# Altium project Newton_Alpha.PrjPcb
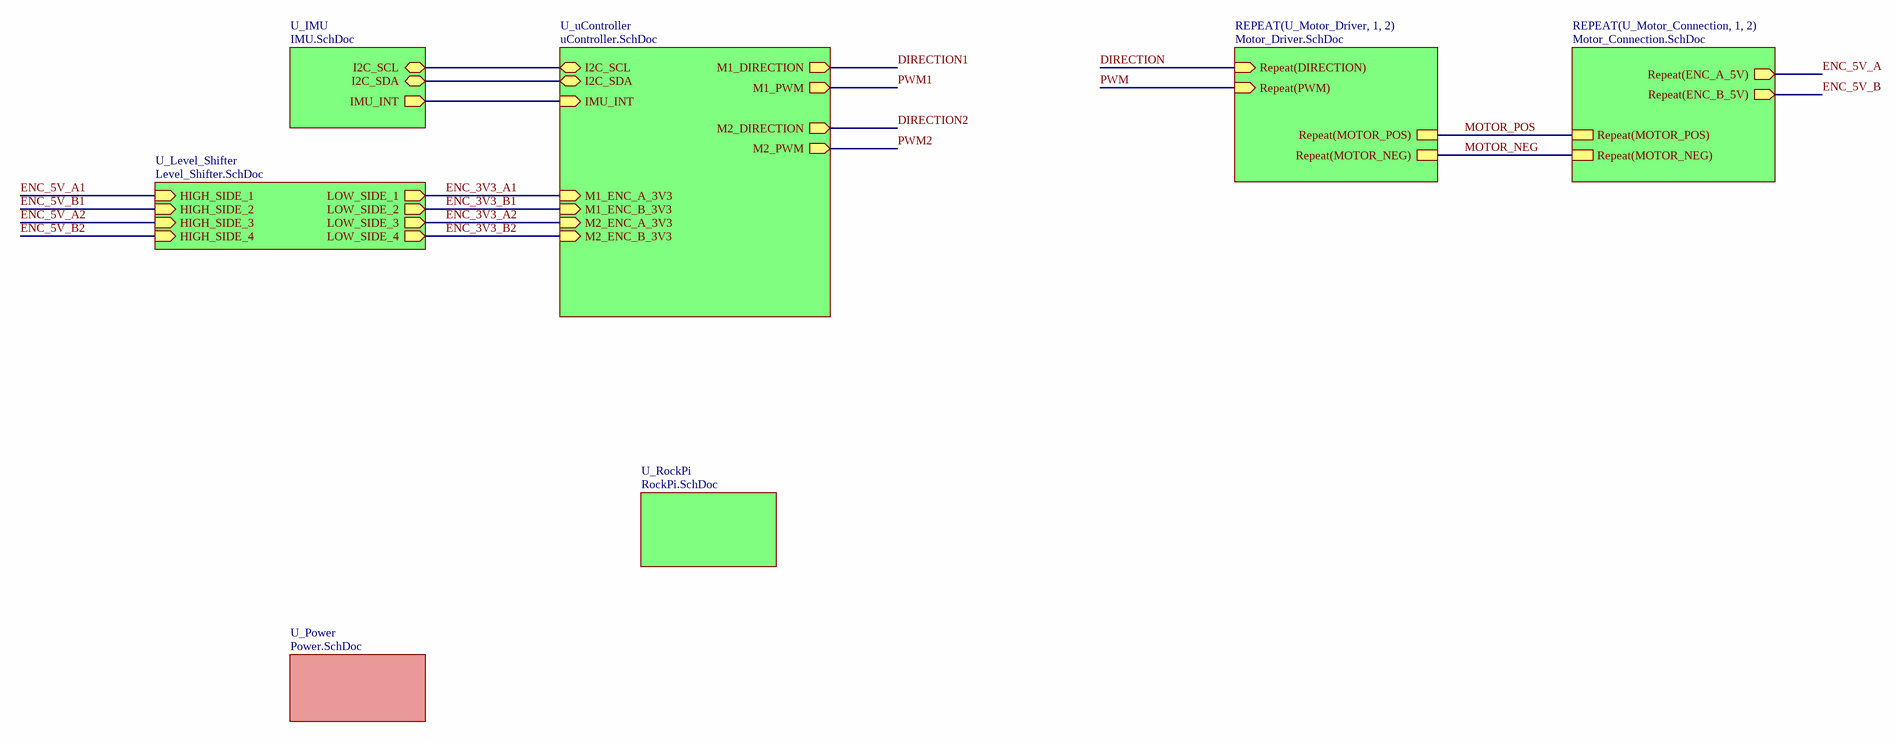
[diagram p0: main.SchDoc]
author: Jamie Smith; microcontroller_sheet_title: microcontroller; revision: A; sheet_total: 3
6 sheets, 83 parts. Net scope: hierarchical (ports join the sheet entries above them; power ports are global).
Board file: PCB-1234.PcbDoc
Sheets:
  main.SchDoc
    U_Power = power.SchDoc
    U_Level_Shifter = Level_Shifter.SchDoc
  headers.SchDoc
  Debug.SchDoc
  microcontroller.SchDoc

## Sheet main.SchDoc
size A3; SheetNumber: 1; SheetTotal: 9

### Sub-sheets
REPEAT(U_Motor_Connection, 1, 2) = Motor_Connection.SchDoc (file not in this document): Repeat(MOTOR_POS), Repeat(MOTOR_NEG), Repeat(ENC_A_5V) (out), Repeat(ENC_B_5V) (out)
REPEAT(U_Motor_Driver, 1, 2) = Motor_Driver.SchDoc (file not in this document): Repeat(DIRECTION) (in), Repeat(MOTOR_NEG), Repeat(MOTOR_POS), Repeat(PWM) (in)
U_IMU = IMU.SchDoc (file not in this document): I2C_SDA (bidir), I2C_SCL (bidir), IMU_INT (out)
U_Level_Shifter = Level_Shifter.SchDoc: HIGH_SIDE_1 (in), HIGH_SIDE_2 (in), HIGH_SIDE_3 (in), HIGH_SIDE_4 (in), LOW_SIDE_1 (out), LOW_SIDE_2 (out), LOW_SIDE_3 (out), LOW_SIDE_4 (out)
U_Power = Power.SchDoc: no entries
U_RockPi = RockPi.SchDoc (file not in this document): no entries
U_uController = uController.SchDoc (file not in this document): M1_PWM (out), M1_DIRECTION (out), I2C_SCL (bidir), M2_PWM (out), M2_DIRECTION (out), I2C_SDA (bidir), IMU_INT (in), M1_ENC_A_3V3 (in), M1_ENC_B_3V3 (in), M2_ENC_A_3V3 (in), M2_ENC_B_3V3 (in)

### Nets
DIRECTION: sheet REPEAT(U_Motor_Driver, 1, 2)/Repeat(DIRECTION)
DIRECTION1: sheet U_uController/M1_DIRECTION
DIRECTION2: sheet U_uController/M2_DIRECTION
ENC_3V3_A1: sheet U_uController/M1_ENC_A_3V3, sheet U_Level_Shifter/LOW_SIDE_1
ENC_3V3_A2: sheet U_uController/M2_ENC_A_3V3, sheet U_Level_Shifter/LOW_SIDE_3
ENC_3V3_B1: sheet U_uController/M1_ENC_B_3V3, sheet U_Level_Shifter/LOW_SIDE_2
ENC_3V3_B2: sheet U_uController/M2_ENC_B_3V3, sheet U_Level_Shifter/LOW_SIDE_4
ENC_5V_A: sheet REPEAT(U_Motor_Connection, 1, 2)/Repeat(ENC_A_5V)
ENC_5V_B: sheet REPEAT(U_Motor_Connection, 1, 2)/Repeat(ENC_B_5V)
MOTOR_NEG: sheet REPEAT(U_Motor_Driver, 1, 2)/Repeat(MOTOR_NEG), sheet REPEAT(U_Motor_Connection, 1, 2)/Repeat(MOTOR_NEG)
MOTOR_POS: sheet REPEAT(U_Motor_Driver, 1, 2)/Repeat(MOTOR_POS), sheet REPEAT(U_Motor_Connection, 1, 2)/Repeat(MOTOR_POS)
PWM: sheet REPEAT(U_Motor_Driver, 1, 2)/Repeat(PWM)
PWM1: sheet U_uController/M1_PWM
PWM2: sheet U_uController/M2_PWM
(unnamed): sheet U_uController/I2C_SCL, sheet U_IMU/I2C_SCL
(unnamed): sheet U_uController/I2C_SDA, sheet U_IMU/I2C_SDA
(unnamed): sheet U_uController/IMU_INT, sheet U_IMU/IMU_INT

### Notes on the sheet
- Sheet Title
- Design Title
- Sheet
- SIZE
- A3
- Designer
- PCB Code
- PCB Rev
- Approver
- Assembly Code
- Issue
- EC No.
- Approved Date

## Sheet power.SchDoc: Power Regulation
size A4; SheetNumber: 2; SheetTotal: 8
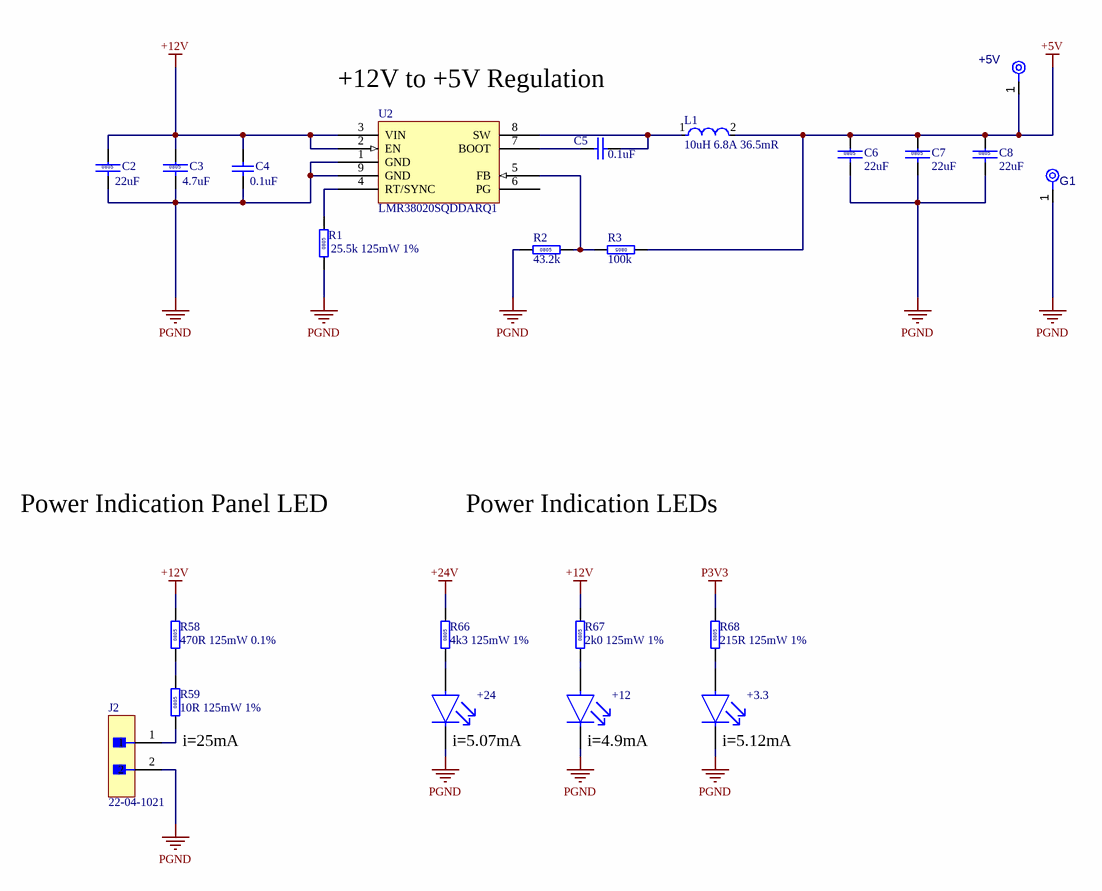
[diagram p1: power.SchDoc]

### Parts
(Parts that share a designator on the sheet are numbered #1, #2 ... from top to bottom, then left to right.)
+3.3  KPTR-3216SGC  [KPTR-3216SGC-Footprint-1 T-variant]  (value not drawn)
+5V  1.7mm Testpoint  [TestPoint_1-7thp]  (value not drawn)  (no BOM)
+12  KPTR-3216SGC  [KPTR-3216SGC-Footprint-1 T-variant]  (value not drawn)
+24  KPTR-3216SGC  [KPTR-3216SGC-Footprint-1 T-variant]  (value not drawn)
C2#1  22uF  [CAPC2012X14N]
C3#1  4.7uF  [CAPC2012X14N]
C4#1  0.1uF  [CAPC2012X14N]
C5#1  0.1uF  [CAPC2012X14N]
C6#1  22uF  [CAPC2012X14N]
C7#1  22uF  [CAPC2012X14N]
C8#1  22uF  [CAPC2012X14N]
G1  1.7mm Testpoint  [TestPoint_1-7thp]  (value not drawn)  (no BOM)
J2#1  22-04-1021  [0022041021_MFG]
L1  10uH 6.8A 36.5mR  [FP-IHLP-4040DZ-FP_3_124x3-MFG]
R1#1  25.5k 125mW 1%  [RESC2013X60X35NL10T20]
R2#1  43.2k  [RESC2013X60X35NL10T20]
R3#1  100k  [RESC2013X60X35NL10T20]
R58  470R 125mW 0.1%  [RESC2013X60X35NL10T20]
R59  10R 125mW 1%  [RESC2013X60X35NL10T20]
R66  4k3 125mW 1%  [RESC2013X60X35NL10T20]
R67  2k0 125mW 1%  [RESC2013X60X35NL10T20]
R68  215R 125mW 1%  [RESC2013X60X35NL10T20]
U2#1  LMR38020SQDDARQ1  [SOIC127P600X170_HS-9N]

### Nets
+5V: +5V.1(TP) C6#1.1 C7#1.1 C8#1.1 L1.2 R3#1.1
+12V: C2#1.1 C3#1.1 C4#1.2 R58.2 R67.2 U2#1.2(EN) U2#1.3(VIN)
+24V: R66.2
P3V3: R68.2
PGND: +3.3.2(C) +12.2(C) +24.2(C) C2#1.2 C3#1.2 C4#1.1 C6#1.2 C7#1.2 C8#1.2 G1.1(TP) J2#1.2 R1#1.1 R2#1.1 U2#1.1(GND) U2#1.9(GND)
Net+3.3_1: +3.3.1(A) R68.1
Net+12_1: +12.1(A) R67.1
Net+24_1: +24.1(A) R66.1
NetC5#1_1: C5#1.1 L1.1 U2#1.8(SW)
NetC5#1_2: C5#1.2 U2#1.7(BOOT)
NetJ2#1_1: J2#1.1 R59.1
NetR1#1_2: R1#1.2 U2#1.4(RT/SYNC)
NetR2#1_2: R2#1.2 R3#1.2 U2#1.5(FB)
NetR58_1: R58.1 R59.2

Not connected (* = marked no-connect by the designer): U2#1 6(PG)

### Notes on the sheet
- +12V to +5V Regulation
- Power Indication Panel LED
- Power Indication LEDs
- (near R59) i=25mA
- (near +24) i=5.07mA
- (near +12) i=4.9mA
- (near +3.3) i=5.12mA

### Library data of the parts
+3.3 +12 +24 = CMP-40-060-00012-8: Single Color LED, Super Bright Green, Water Clear, 1.6mm; Manufacturer: Kingbright; Reverse Voltage-Max: 5V; Overall Height: 1.05mm; Forward Current: 25mA; Forward Voltage: 2.5V; Channels: 1; Shape: Rectangular; ComponentLinkDescription: Datasheet; Luminous Intensity-Nom: 15mcd; Viewing Angle: 120°; Luminous Intensity-Min: 120cd; Packaging: Tape and Reel; Maximum Operating Temperature: 85°C; Color: Green; Min Operating Temperature: -40°C; Mounting Technology: Surface Mount; Reach SVHC Compliant: Yes; Color@wavelength: Green; Lens Style: WATER CLEAR; Terminal Pitch: 3.6mm; ForwardVoltage: 2.5V; ManufacturerPartNumber: KPTR-3216SGC; ComponentLinkURL: https://datasheet.ciiva.com/pdfs/VipMasterIC/IC/KNGB/KNGBS03251/KNGBS03251-1.pdf?src-supplier=IHS+Markit; Minimum Operating Temperature: -40°C; Max Operating Temperature: 85°C; RoHS Compliant: Yes; MountingType: SMD; Size: 1.6mm; Pins: 2; Optoelectronic Device Type: SINGLE COLOR LED; Colour: Super Bright Green; Package: 1206
+5V G1 = CMP-40-090-00002-6: NON BOM, Tespoint, Plated, Electrically Connected
C2#1 C6#1 C7#1 C8#1 = CMP-40-005-00017-4: Cap, SMD, 22uF, 25V, 15%, 0805, X5R; Manufacturer: Murata; ManufacturerPartNumber: GRM21BR61E226ME44L; ComponentLinkDescription: Datasheet; CapacitorType: Ceramic; Value: 22µF; MountingType: SMD; DielectricType: X5R; ComponentLinkURL: https://www.murata.com/en-us/products/productdetail?partno=GRM21BR61E226ME44%23; Package: 0805; VoltageRating: 25V; Tolerance: 15%
C3#1 = CMP-40-005-00016-4: Cap, SMD, 4.7uF, 50V, 10%, 0805, X5R; Manufacturer: Murata; ManufacturerPartNumber: GRM21BR61H475KE51L; ComponentLinkDescription: Datasheet; Value: 4.7µF; CapacitorType: Ceramic; DielectricType: X5R; Package: 0805; VoltageRating: 50V; MountingType: SMD; Tolerance: 10%; ComponentLinkURL: https://www.murata.com/en-us/products/productdetail?partno=GRM21BR61H475KE51%23
C4#1 C5#1 = CMP-40-005-00117-1: Cap, SMD, 0.1uF, 50V, 10%, 0805, X7R; Manufacturer: Samsung; ManufacturerPartNumber: CL21B104KBCWPNC; CapacitorType: Ceramic; Value: 100nF; ComponentLinkDescription: Datasheet; Package: 0805; MountingType: SMD; VoltageRating: 50V; Tolerance: 10%; ComponentLinkURL: https://octopart.com/part/samsung-electro-mechanics/CL21B104KBCWPNC; DielectricType: Ceramic
J2#1 = CMP-40-050-00147-1: Pin Header, Wire-to-Board, 2.5 mm, 1 Rows, 2 Contacts, Through Hole Straight, KK 5045 Series; Manufacturer: Molex; Current Rating: 3A; ComponentLinkDescription: Datasheet; Jack/Receptacle: Male; Number of Ways: 2; MountingType: Through hole; ManufacturerPartNumber: 22-04-1021; ConnectorType: Header; Number of Rows: 1; ComponentLinkURL: https://octopart.com/part/molex/22-04-1021
L1 = CMP-40-020-00018-1: Ind, SMD, 10uH, 46.5mR, las = 12.0A; Manufacturer: Vishay; ManufacturerPartNumber: IHLP4040DZER100MA1; Value: 10µH; Saturation Current: 12A; Tolerance: 20%; ComponentLinkDescription: Datasheet; MountingType: 2; Max Current Rating: 6.8A; ComponentLinkURL: https://octopart.com/part/vishay/IHLP4040DZER100MA1; Package: Nonstamdard
R1#1 = CMP-40-025-00256-1: Res, SMD, 25.5k, 125mW, 1%, ±100ppm, 0805; ManufacturerPartNumber: ERJ-6ENF2552V; Manufacturer: Panasonic; ComponentLinkDescription: Datasheet; Package Height: 0.6mm; Voltage Rating: 150V; Temperature Coefficient (ppm/cel): ±100ppm; RoHS3Compliant: Yes; Max Operating Temperature: 155°C; Mount: SMD; Min Operating Temperature: -55°C; Composition: Thick Film; Case/Package: 0805; Number of Pins: 2; Contact Plating: Tin; Power Rating: 125mW; Reach SVHC Compliant: Unaffected; Resistor Type: Fixed; ComponentLinkURL: https://octopart.com/part/panasonic/ERJ-6ENF2552V; Resistance: 25.5k; Tolerance: 1%
R2#1 = CMP-40-025-00258-1: Res, SMD, 43.2k 125mW, 0.1%, ±25ppm, 0805; ManufacturerPartNumber: ERA6AEB4322V; Manufacturer: Panasonic; Voltage Rating: 100V; ComponentLinkDescription: Datasheet; Package Height: 0.6mm; Composition: Metal Film, Thin Film; ComponentLinkURL: https://octopart.com/part/panasonic/ERA6AEB4322V; Temperature Coefficient (ppm/cel): ±25ppm; Tolerance: 0.1%; Case/Package: 0805; Max Operating Temperature: 155°C; Power Rating: 125mW; RoHS3Compliant: Yes; Reach SVHC Compliant: Unaffected; Min Operating Temperature: -55°C; Mount: SMD; Contact Plating: Tin; Resistor Type: Fixed; Number of Pins: 2; Resistance: 43.2k
R3#1 = CMP-40-025-00231-1: Res, SMD, 100k, 125mW, 0.1%, ±25ppm, 0805; Manufacturer: Panasonic; ManufacturerPartNumber: ERA-6AEB104V; Voltage Rating: 100V; ComponentLinkDescription: Datasheet; Package Height: 0.6; Power Rating: 125mW; Resistor Type: Fixed; RoHS3Certificate: https://download.siliconexpert.com/pdfs2/2024/6/2/9/59/48/925943/pns_/manual/erj6enf2700v_rohs.pdf; Mount: SMD; Case/Package: 0805; Composition: Thin Film; Temperature Coefficient (ppm/cel): ±25ppm; Min Operating Temperature: -55°C; ComponentLinkURL: https://octopart.com/era-6aeb104v-panasonic-1193246; Tolerance: 0.1%; Number of Pins: 2; Reach SVHC Compliant: Unaffected; RoHS3Compliant: Yes (with excemption); Contact Plating: Tin; Max Operating Temperature: 155°C; Resistance: 100k
R58 = CMP-40-025-00266-1: Res, SMD, 470R, 125mW, 0.1%, ±25ppm, 0805; ManufacturerPartNumber: ERA6AEB471V; Manufacturer: Panasonic; Resistance: 470; Package Height: 0.6mm; ComponentLinkDescription: Datasheet; Voltage Rating: 100V; Number of Pins: 2; ComponentLinkURL: https://octopart.com/part/panasonic/ERA6AEB471V; Case/Package: 0805; RoHS3Compliant: Yes; Tolerance: 0.1%; Resistor Type: Fixed; Reach SVHC Compliant: Unaffected; Composition: Thin Film; Temperature Coefficient (ppm/cel): ±25ppm; Max Operating Temperature: 155°C; Power Rating: 125mW; Mount: SMD; Min Operating Temperature: -55°C; Contact Plating: Tin
R59 = CMP-40-025-00265-1: Res, SMD, 10R, 125mW, 1%, ±100ppm, 0805; Manufacturer: Panasonic; ManufacturerPartNumber: ERJ-6ENF10R0V; Resistance: 10; ComponentLinkDescription: Datasheet; Voltage Rating: 150V; Package Height: 0.6mm; Min Operating Temperature: -55°C; Resistor Type: Fixed; Reach SVHC Compliant: Unaffected; Contact Plating: Tin; Temperature Coefficient (ppm/cel): ±100ppm; Mount: SMD; Power Rating: 125mW; Max Operating Temperature: 155°C; Composition: Thick Film; ComponentLinkURL: https://octopart.com/part/panasonic/ERJ-6ENF10R0V; Case/Package: 0805; Number of Pins: 2; RoHS3Compliant: Yes; Tolerance: 1%
R66 = CMP-40-025-00245-1: Res, SMD, 4k3, 125mW, 1%, ±100ppm, 0805; ManufacturerPartNumber: ERJ-6ENF4301V; Manufacturer: Panasonic; Package Height: 0.6mm; ComponentLinkDescription: Datasheet; Resistance: 4.3k; Voltage Rating: 150V; Temperature Coefficient (ppm/cel): ±100ppm; Reach SVHC Compliant: Unaffected; Tolerance: 1%; ComponentLinkURL: https://octopart.com/part/panasonic/ERJ-6ENF4301V; Power Rating: 125mW; Resistor Type: Fixed; Contact Plating: Tin; Max Operating Temperature: 155°C; Number of Pins: 2; Min Operating Temperature: -55°C; Mount: SMD; Case/Package: 0805; Composition: Thick Film; RoHS3Compliant: Yes (with excemption)
R67 = CMP-40-025-00259-1: Res, SMD, 2k0, 125mW, 1%, ±100ppm, 0805; ManufacturerPartNumber: ERJ-6ENF2001V; Manufacturer: Panasonic; Voltage Rating: 150V; Package Height: 0.6mm; ComponentLinkDescription: Datasheet; Resistance: 2k; Power Rating: 125mW; Mount: SMD; RoHS3Compliant: Yes; Case/Package: 0805; Max Operating Temperature: 155°C; Reach SVHC Compliant: Unaffected; Composition: Thick Film; Contact Plating: Tin; Tolerance: 1%; Temperature Coefficient (ppm/cel): ±100ppm; Number of Pins: 2; Min Operating Temperature: -55°C; Resistor Type: Fixed; ComponentLinkURL: https://octopart.com/part/panasonic/ERJ-6ENF2001V
R68 = CMP-40-025-00246-1: Res, SMD, 215R, 125mW, 1%, ±100ppm, 0805; ManufacturerPartNumber: ERJ-6ENF2150V; Manufacturer: Panasonic; Voltage Rating: 150V; ComponentLinkDescription: Datasheet; Package Height: 0.6; Resistance: 215; Temperature Coefficient (ppm/cel): ±100ppm; Tolerance: 1%; ComponentLinkURL: https://octopart.com/part/panasonic/ERJ-6ENF2150V; RoHS3Compliant: Yes (with excemption); Power Rating: 125mW; Reach SVHC Compliant: Unaffected; Number of Pins: 2; Composition: Thick Film; Resistor Type: Fixed; Max Operating Temperature: 155°C; Contact Plating: Tin; Mount: SMD; Min Operating Temperature: -55°C; Case/Package: 0805
U2#1 = CMP-40-080-00204-2: Switching Regulator, Current-mode, 2A, 2200kHz Switching Freq-Max, PDSO8; Manufacturer: Texas Instruments; ComponentLinkDescription: Datasheet; ComponentLinkURL: https://octopart.com/part/texas-instruments/LMR38020SQDDARQ1; Package: DDA Package, 8-Pin HSOIC; MountingType: SMD; Type: Switcher; ManufacturerPartNumber: LMR38020SQDDARQ1

## Sheet Level_Shifter.SchDoc
size A4; SheetNumber: 8; SheetTotal: 8
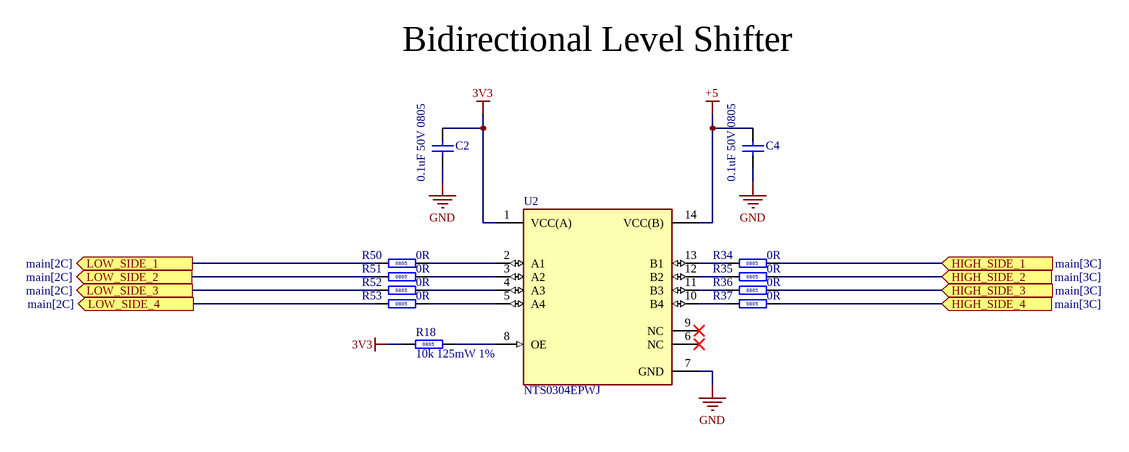
[diagram p2: Level_Shifter.SchDoc]

### Parts
(Parts that share a designator on the sheet are numbered #1, #2 ... from top to bottom, then left to right.)
C2#2  0.1uF 50V 0805  [CAPC2012X14N]
C4#2  0.1uF 50V 0805  [CAPC2012X14N]
R18  10k 125mW 1%  [RESC2013X60X35LL10T20]
R34  0R  [Copy of RESC2013X60X35NL10T20]
R35  0R  [Copy of RESC2013X60X35NL10T20]
R36  0R  [Copy of RESC2013X60X35NL10T20]
R37  0R  [Copy of RESC2013X60X35NL10T20]
R50  0R  [Copy of RESC2013X60X35NL10T20]
R51  0R  [Copy of RESC2013X60X35NL10T20]
R52  0R  [Copy of RESC2013X60X35NL10T20]
R53  0R  [Copy of RESC2013X60X35NL10T20]
U2#2  NTS0304EPWJ  [FP-SOT402-1-MFG]

### Ports
HIGH_SIDE_1 (in, see main[3C]), HIGH_SIDE_2 (in, see main[3C]), HIGH_SIDE_3 (in, see main[3C]), HIGH_SIDE_4 (in, see main[3C]), LOW_SIDE_1 (out, see main[2C]), LOW_SIDE_2 (out, see main[2C]), LOW_SIDE_3 (out, see main[2C]), LOW_SIDE_4 (out, see main[2C])

### Nets
3V3: C2#2.2 R18.1 U2#2.1(VCC(A))
+5: C4#2.2 U2#2.14(VCC(B))
GND: C2#2.1 C4#2.1 U2#2.7(GND)
ENC_3V3_A1: R50.1 ; port LOW_SIDE_1
ENC_3V3_A2: R52.1 ; port LOW_SIDE_3
ENC_3V3_B1: R51.1 ; port LOW_SIDE_2
ENC_3V3_B2: R53.1 ; port LOW_SIDE_4
ENC_5V_A1: R34.2 ; port HIGH_SIDE_1
ENC_5V_A2: R36.2 ; port HIGH_SIDE_3
ENC_5V_B1: R35.2 ; port HIGH_SIDE_2
ENC_5V_B2: R37.2 ; port HIGH_SIDE_4
NetR18_2: R18.2 U2#2.8(OE)
NetR34_1: R34.1 U2#2.13(B1)
NetR35_1: R35.1 U2#2.12(B2)
NetR36_1: R36.1 U2#2.11(B3)
NetR37_1: R37.1 U2#2.10(B4)
NetR50_2: R50.2 U2#2.2(A1)
NetR51_2: R51.2 U2#2.3(A2)
NetR52_2: R52.2 U2#2.4(A3)
NetR53_2: R53.2 U2#2.5(A4)

Not connected (* = marked no-connect by the designer): U2#2 6(NC)* 9(NC)*

### Notes on the sheet
- Bidirectional Level Shifter

### Library data of the parts
C2#2 C4#2 = CMP-40-005-00117-1: as C4#1 on sheet power; Package: 0805; MountingType: SMD; VoltageRating: 50V; Tolerance: 10%; ComponentLinkURL: https://octopart.com/part/samsung-electro-mechanics/CL21B104KBCWPNC; DielectricType: Ceramic
R18 = CMP-40-025-00226-1: Res, SMD, 10k, 125mW, 1%, ±200ppm, 0805; Manufacturer: Panasonic; ManufacturerPartNumber: ERJ-6GEYJ103V; Package Height: 0.6mm; ComponentLinkDescription: Datasheet; Voltage Rating: 150V; Tolerance: 5%; RoHS3Certificate: https://download.siliconexpert.com/pdfs2/2024/6/2/9/59/48/925943/pns_/manual/erj6enf2700v_rohs.pdf; Composition: Thick Film; Contact Plating: Tin; Reach SVHC Compliant: Unaffected; ComponentLinkURL: https://octopart.com/erj-6geyj103v-panasonic-55422885; Temperature Coefficient (ppm/cel): ±200ppm; Resistance: 10k; Max Operating Temperature: 155°C; Mount: SMD; Number of Pins: 2; Case/Package: 0805; RoHS3Compliant: Yes (with exeption); Power Rating: 125mW; Resistor Type: Fixed; Min Operating Temperature: -55°C
R34-R37 R50-R53 = CMP-40-025-00156-5: Res, SMD, 0R, 0.125W, 1%, 0805; Manufacturer: Yageo; ManufacturerPartNumber: RC0805JR-070RL; ComponentLinkDescription: Datasheet; Package Height: 0.5mm; PowerRating: 125mW; Package Length: 2mm; Value: 0; Rated Temperature: 70°C; Package Width: 1.25mm; Termination: Wraparound; Mounting Technology: Surface Mount; Resistor Type: FIXED RESISTOR; MountingType: SMD; Max Operating Temperature: 155°C; Construction: Chip; RoHS Compliant: Yes; Power: 125mW; Tolerance: 1%; Packaging: Tape and Reel; Pins: 2; Min Operating Temperature: -55°C; Package: 0805; Terminal Finish: Nickel; Package Style: SMTMeter; Case/Package: 0805; Package Shape: Rectangular; ComponentLinkURL: https://datasheet.ciiva.com/pdfs/VipMasterIC/IC/YAGO/YAGO-S-A0008145938/YAGO-S-A0008145938-1.pdf?src-supplier=IHS+Markit; Minimum Operating Temperature: -55°C; Technology: METAL GLAZE/THICK FILM; JESD-609 Code: e3; Maximum Operating Temperature: 155°C; Reach SVHC Compliant: Yes
U2#2 = CMP-10125-000002-1: 4-BIT VOLTAGE TRANSLATOR 14TSSOP; Manufacturer: NXP; Number Of Circuits: 4; Logic Function Desc: Translating Transceiver; Data Rate: 20Mbits/s; Standoff Height: 0.05mm; Min Supply Voltage: 0.95V; Nominal Supply Current: 2.2-18uA; V A Max: 4.6V; Max Supply Voltage: 5.5V; Max Junction Temp: +85°C; V B Min: -0.5V; V B Max: 6.5V; Propagation Delay: 5.3ns; Package: SOT402-1; Device Class L1: Integrated Circuits (ICs); Temperature Range High: +85°C; Number Of Outputs: 4; Temperature: -40°C to +85°C; Category: IC; Octopart: https://octopart.com/nts0304epwj-nxp+semiconductors-97865291; Ambient Temperature Range High: +125°C; Automotive: No; Device Class L3: Voltage Level Shifters; Digikey Description: 4-BIT VOLTAGE TRANSLATOR 14TSSOP; RoHS: TRUE; Lead Free: Yes; Manufacturer Part Number: NTS0304EPWJ; ComponentLink2Description: Datasheet; Number Of Inputs: 4; Footprint Url: https://www.nxp.com/docs/en/package-information/SOT402-1.pdf; Ambient Temperature Range Low: -40°C; Temperature Range Low: -40°C; V A Min: -0.5V; ComponentLink2URL: https://www.nxp.com/docs/en/data-sheet/NTS0304E.pdf; Device Class L2: Logic ICs; Height: 1.1mm

## Sheet headers.SchDoc: External Connections
size A4; SheetNumber: 6; SheetTotal: 8
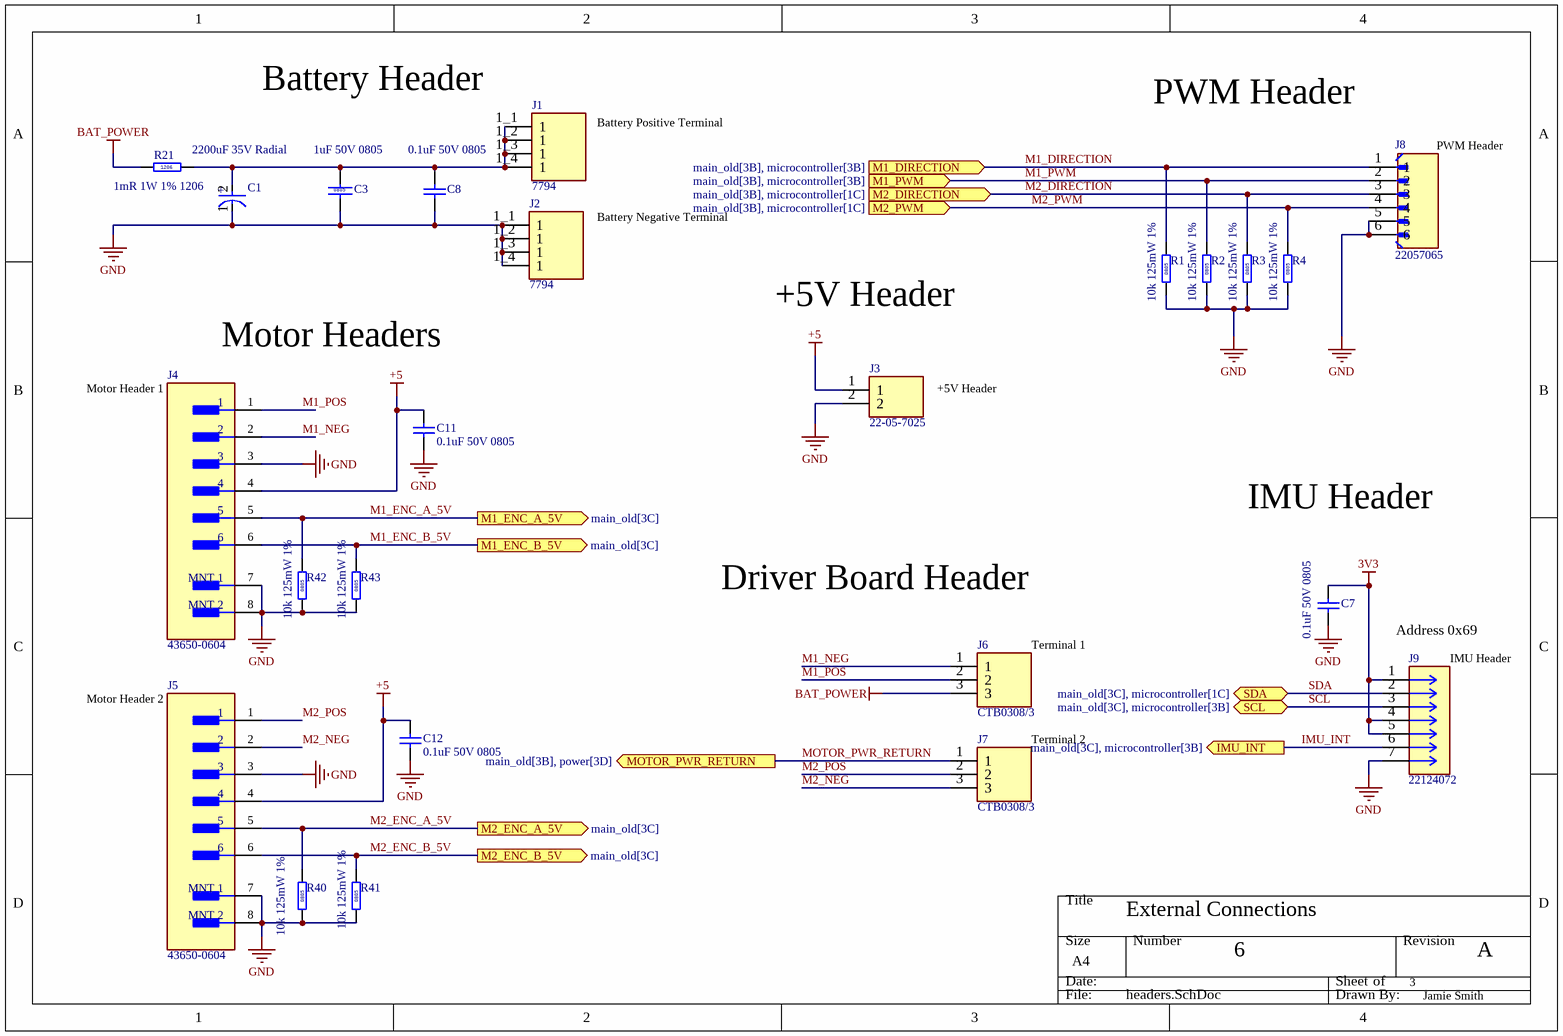
[diagram p3: headers.SchDoc]

### Parts
(Parts that share a designator on the sheet are numbered #1, #2 ... from top to bottom, then left to right.)
C1  2200uF 35V Radial  [FP-RAD-TH-D_16_0_5-L_25_2-MFG]
C3#2  1uF 50V 0805  [CAPC2012X14N]
C7#2  0.1uF 50V 0805  [CAPC2012X14N]
C8#2  0.1uF 50V 0805  [CAPC2012X14N]
C11  0.1uF 50V 0805  [CAPC2012X14N]
C12  0.1uF 50V 0805  [CAPC2012X14N]
J1  7794  [KEYSTONE_7794]
J2#2  7794  [KEYSTONE_7794]
J3  22-05-7025  [MOLEX_22-05-7025]
J4  43650-0604  [FP-43650-0604-MFG]
J5  43650-0604  [FP-43650-0604-MFG]
J6  CTB0308/3  [CTB0308_3-Footprint-1]
J7  CTB0308/3  [CTB0308_3-Footprint-1]
J8  22057065  [MOLEX_22057065]
J9  22124072  [CONN_A-7395-07B_MOL]
R1#2  10k 125mW 1%  [RESC2013X60X35ML10T20]
R2#2  10k 125mW 1%  [RESC2013X60X35ML10T20]
R3#2  10k 125mW 1%  [RESC2013X60X35ML10T20]
R4  10k 125mW 1%  [RESC2013X60X35ML10T20]
R21  1mR 1W 1% 1206  [FP-CSRF1206-IPC_A]
R40  10k 125mW 1%  [RESC2013X60X35ML10T20]
R41  10k 125mW 1%  [RESC2013X60X35ML10T20]
R42  10k 125mW 1%  [RESC2013X60X35ML10T20]
R43  10k 125mW 1%  [RESC2013X60X35ML10T20]

### Ports
IMU_INT (out, see main_old[3C], microcontroller[3B]), M1_DIRECTION (in, see main_old[3B], microcontroller[3B]), M1_ENC_A_5V (out, see main_old[3C]), M1_ENC_B_5V (out, see main_old[3C]), M1_PWM (in, see main_old[3B], microcontroller[3B]), M2_DIRECTION (in, see main_old[3B], microcontroller[1C]), M2_ENC_A_5V (out, see main_old[3C]), M2_ENC_B_5V (out, see main_old[3C]), M2_PWM (in, see main_old[3B], microcontroller[1C]), MOTOR_PWR_RETURN (out, see main_old[3B], power[3D]), SCL (bidir, see main_old[3C], microcontroller[3B]), SDA (bidir, see main_old[3C], microcontroller[1C])

### Nets
3V3: C7#2.2 J9.1 J9.4 J9.5
+5: C11.2 C12.2 J3.1 J4.4 J5.4
BAT_POWER: J6.3 R21.1
GND: C1.1(C) C3#2.2 C7#2.1 C8#2.1 C11.1 C12.1 J2#2.1_1(1) J2#2.1_2(1) J2#2.1_3(1) J2#2.1_4(1) J3.2 J4.3 J4.7(MNT_1) J4.8(MNT_2) J5.3 J5.7(MNT_1) J5.8(MNT_2) J8.5 J8.6 J9.7 R1#2.1 R2#2.1 R3#2.1 R4.1 R40.1 R41.1 R42.1 R43.1
IMU_INT: J9.6 ; port IMU_INT
M1_DIRECTION: J8.1 R1#2.2 ; port M1_DIRECTION
M1_ENC_A_5V: J4.5 R42.2 ; port M1_ENC_A_5V
M1_ENC_B_5V: J4.6 R43.2 ; port M1_ENC_B_5V
M1_NEG: J4.2 J6.1
M1_POS: J4.1 J6.2
M1_PWM: J8.2 R2#2.2 ; port M1_PWM
M2_DIRECTION: J8.3 R3#2.2 ; port M2_DIRECTION
M2_ENC_A_5V: J5.5 R40.2 ; port M2_ENC_A_5V
M2_ENC_B_5V: J5.6 R41.2 ; port M2_ENC_B_5V
M2_NEG: J5.2 J7.3
M2_POS: J5.1 J7.2
M2_PWM: J8.4 R4.2 ; port M2_PWM
MOTOR_PWR_RETURN: J7.1 ; port MOTOR_PWR_RETURN
SCL: J9.3 ; port SCL
SDA: J9.2 ; port SDA
NetC1_2: C1.2(A) C3#2.1 C8#2.2 J1.1_1(1) J1.1_2(1) J1.1_3(1) J1.1_4(1) R21.2

### Notes on the sheet
- (near J1) Battery Header
- PWM Header
- Battery Positive Terminal
- (near J8) PWM Header
- Battery Negative Terminal
- +5V Header
- Motor Headers
- Motor Header 1
- IMU Header
- Driver Board Header
- Terminal 1
- (near J9) Address 0x69
- Motor Header 2
- (near J9) IMU Header
- Terminal 2
- Sheet Title
- Design Title
- Sheet
- SIZE
- C
- Designer
- PCB Code
- PCB Rev
- Approver
- Assembly Code
- Issue
- EC No.
- Approved Date
- (in symbol CMP-05427-000859-1) +

### Library data of the parts
C1 = CMP-05427-000859-1: Aluminum Electrolytic Capacitors (Radial Lead Type) 2200uF ±20% 35V
C3#2 = CMP-40-005-00008-4: Cap, SMD, 1uF, 50V, 10%, 0805, X7R; ManufacturerPartNumber: CL21B105KBFNNN; Manufacturer: Samsung Electro Mechanics; CapacitorType: Ceramic; Value: 1µF; ComponentLinkDescription: Datasheet; VoltageRating: 50V; MountingType: SMD; Package: 0805; ComponentLinkURL: http://weblib.samsungsem.com/mlcc/mlcc-ec-data-sheet.do?partNumber=CL21B105KBFNNN; Tolerance: 10%; DielectricType: X7R
C7#2 C8#2 C11 C12 = CMP-40-005-00117-1: as C4#1 on sheet power; Package: 0805; MountingType: SMD; VoltageRating: 50V; Tolerance: 10%; ComponentLinkURL: https://octopart.com/part/samsung-electro-mechanics/CL21B104KBCWPNC; DielectricType: Ceramic
J1 J2#2 = 7794: PC SCREW TERMINAL | Keystone Electronics 7794; SnapEDA_Link: https://www.snapeda.com/parts/7794/Keystone/view-part/?ref=snap; Package: None; Value: *; MF: Keystone Electronics; MP: 7794; Check_prices: https://www.snapeda.com/parts/7794/Keystone/view-part/?ref=eda
J3 = 22-05-7025: Header 2.5mm SPOX, WTB, RA, F/lock, 2w | Molex Incorporated 22-05-7025; SnapEDA_Link: https://www.snapeda.com/parts/22-05-7025/Molex/view-part/?ref=snap; Package: None; Value: *; MF: Molex; MP: 22-05-7025; Check_prices: https://www.snapeda.com/parts/22-05-7025/Molex/view-part/?ref=eda
J4 J5 = CMP-00257-00298091-1: 43650-0604 Conn Power HDR 6 POS 3mm Solder RA Thru-Hole 6 Terminal 1 Port Micro-Fit 3.0™ Frame; Manufacturer Lifecycle Status: ACTIVE; NexarPartId: 298091; Gender: Male; Number of Contacts: 6; Current Rating: 5A; Plating: Tin; Glow Wire Compliant: Compliant; Voltage Rating: 600V; Connector Type: Male Pin; Contact Material: Brass; Color: Black; Housing Material: Plastic; Contact Gender: Male; Halogen Free: Low Halogen; Min Operating Temperature: -40°C; Pitch: 3mm; Housing Color: Black; Lifecycle Status: Production; Termination: Solder; Width: 9.9mm; Orientation: Right Angle; Length: 21.6mm; Lead Free: Contains Lead; Number of Pins: 6; Max Operating Temperature: 105°C; Number of Positions: 6; Number of Rows: 1; RoHS: Compliant; Number of Circuits: 6; Country of Origin: US; Mount: Through Hole; Contact Plating: Gold; Schedule B: 8536694040; Fastening Type: Ramp; Height: 4.37mm
J6 J7 = CMP-40-050-00115-1: Barrier Strip Terminal Block, 3 position; ManufacturerPartNumber: CTB0308_3; Manufacturer: CAMDENBOSS; VoltageRating: 130V; Number of Ways: 3; ComponentLinkDescription: Datasheet; Current Rating: 10A; Jack/Receptacle: Receptacle; ComponentLinkURL: https://datasheet.ciiva.com/pdfs/VipMasterIC/IC/CAME/CAMES00005/CAMES00005-1.pdf?src-supplier=IHS+Markit; Minimum Operating Temperature: 0°C; REACHStatement: No; Number of Rows: 1; Terminal and Terminal Block Type: BARRIER STRIP TERMINAL BLOCK; Manufacturer Series: CTB0308; RoHS3Compliant: Yes; MountingType: TH; RoHS3Certificate: Yes; ConnectorType: Terminal Block; Maximum Operating Temperature: 110°C
J8 = 22057065: Conn Shrouded Header (4 Sides) HDR 6 POS 2.5mm Solder RA Side Entry Thru-Hole SPOXâ„¢ Bag; MF: Molex; SnapEDA_Link: https://www.snapeda.com/parts/22057065/Molex/view-part/?ref=snap; Package: None; Value: *; MP: 22057065; Check_prices: https://www.snapeda.com/parts/22057065/Molex/view-part/?ref=eda
R1#2 R2#2 R3#2 R4 R40-R43 = CMP-40-025-00226-1: as R18 on sheet Level_Shifter; RoHS3Certificate: https://download.siliconexpert.com/pdfs2/2024/6/2/9/59/48/925943/pns_/manual/erj6enf2700v_rohs.pdf; Composition: Thick Film; Contact Plating: Tin; Reach SVHC Compliant: Unaffected; ComponentLinkURL: https://octopart.com/erj-6geyj103v-panasonic-55422885; Temperature Coefficient (ppm/cel): ±200ppm; Resistance: 10k; Max Operating Temperature: 155°C; Mount: SMD; Number of Pins: 2; Case/Package: 0805; RoHS3Compliant: Yes (with exeption); Power Rating: 125mW; Resistor Type: Fixed; Min Operating Temperature: -55°C
R21 = CMP-40-025-00210-2: Res, SMD, 1mR, 1W, 0.0316V, 1% +/-Tol, 50ppm/Cel, 1206; ManufacturerPartNumber: CRF1206-FZ-R001ELF; Manufacturer: Bourns; ComponentLinkDescription: Datasheet; Value: 1m; ComponentLinkURL: https://datasheet.octopart.com/CRF1206-FZ-R001ELF-Bourns-datasheet-176301116.pdf?src-supplier=Electro+Sonic; Mount: SMD; MountingType: SMD; Package: 1206; Tolerance: 1%; PowerRating: 1W
J9 = 22124072: Package: None; Price: None; Value: *; MP: 22124072; Availability: Unavailable

## Sheet Debug.SchDoc
size A4; SheetNumber: 11; SheetTotal: 13
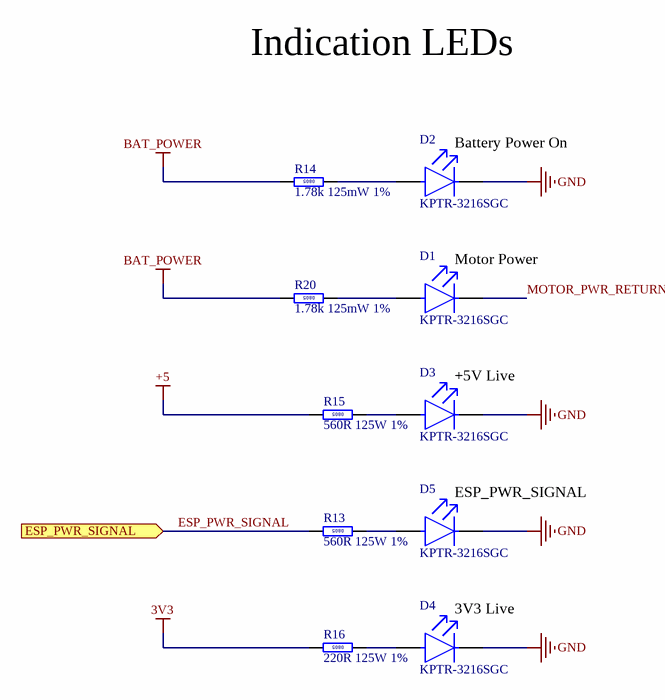
[diagram p4: Debug.SchDoc]

### Parts
D1  KPTR-3216SGC  [KPTR-3216SGC-Footprint-1]
D2  KPTR-3216SGC  [KPTR-3216SGC-Footprint-1]
D3  KPTR-3216SGC  [KPTR-3216SGC-Footprint-1]
D4  KPTR-3216SGC  [KPTR-3216SGC-Footprint-1]
D5  KPTR-3216SGC  [KPTR-3216SGC-Footprint-1]
R13  560R 125W 1%  [RESC2013X60X35LL10T20]
R14  1.78k 125mW 1%  [RESC2013X60X35LL10T20]
R15  560R 125W 1%  [RESC2013X60X35LL10T20]
R16  220R 125W 1%  [RESC2013X60X35LL10T20]
R20  1.78k 125mW 1%  [RESC2013X60X35LL10T20]

### Ports
ESP_PWR_SIGNAL (in)

### Nets
3V3: R16.2
+5: R15.2
BAT_POWER: R14.2 R20.2
GND: D2.2(C) D3.2(C) D4.2(C) D5.2(C)
ESP_PWR_SIGNAL: R13.2 ; port ESP_PWR_SIGNAL
MOTOR_PWR_RETURN: D1.2(C)
NetD1_1: D1.1(A) R20.1
NetD2_1: D2.1(A) R14.1
NetD3_1: D3.1(A) R15.1
NetD4_1: D4.1(A) R16.1
NetD5_1: D5.1(A) R13.1

### Notes on the sheet
- Indication LEDs
- (near D2) Battery Power On
- (near D1) Motor Power
- (near D3) +5V Live
- (near D5) ESP_PWR_SIGNAL
- (near D4) 3V3 Live

### Library data of the parts
D1-D5 = CMP-40-060-00012-7: Single Color LED, Super Bright Green, Water Clear, 1.6mm; Manufacturer: Kingbright; Reverse Voltage-Max: 5V; Overall Height: 1.05mm; Channels: 1; Luminous Intensity-Nom: 15mcd; Forward Voltage: 2.5V; Shape: Rectangular; Luminous Intensity-Min: 120cd; Viewing Angle: 120°; Forward Current: 25mA; ComponentLinkDescription: Datasheet; Terminal Pitch: 3.6mm; Size: 1.6mm; Colour: Super Bright Green; Min Operating Temperature: -40°C; Max Operating Temperature: 85°C; Package: 1206; ComponentLinkURL: https://datasheet.ciiva.com/pdfs/VipMasterIC/IC/KNGB/KNGBS03251/KNGBS03251-1.pdf?src-supplier=IHS+Markit; RoHS Compliant: Yes; Color@wavelength: Green; Maximum Operating Temperature: 85°C; Packaging: Tape and Reel; Minimum Operating Temperature: -40°C; ManufacturerPartNumber: KPTR-3216SGC; Pins: 2; Optoelectronic Device Type: SINGLE COLOR LED; Color: Green; MountingType: SMD; Reach SVHC Compliant: Yes; ForwardVoltage: 2.5V; Lens Style: WATER CLEAR; Mounting Technology: Surface Mount
R13 R15 R16 = CMP-40-025-00230-1: Res, SMD, 560R, 125mW, 1%, ±100ppm, 0805; Manufacturer: Panasonic; ManufacturerPartNumber: ERJ-6ENF5600V; Package Height: 0.6; ComponentLinkDescription: Datasheet; Voltage Rating: 150V; Resistance: 560; Max Operating Temperature: 155°C; Tolerance: 1%; Composition: Thick Film; Min Operating Temperature: -55°C; ComponentLinkURL: https://octopart.com/erj-6enf5600v-panasonic-55477609; RoHS3Compliant: Yes (with excemption); Case/Package: 0805; Mount: SMD; Contact Plating: Tin; RoHS3Certificate: https://download.siliconexpert.com/pdfs2/2024/6/2/9/59/48/925943/pns_/manual/erj6enf2700v_rohs.pdf; Number of Pins: 2; Power Rating: 125mW; Temperature Coefficient (ppm/cel): ±100ppm; Reach SVHC Compliant: Unaffected; Resistor Type: Fixed
R14 R20 = CMP-40-025-00237-1: Res, SMD, 1.78k, 125mW, 1%, ±100ppm, 0805; Manufacturer: Panasonic; ManufacturerPartNumber: ERJ-6ENF1781V; ComponentLinkDescription: Datasheet; Voltage Rating: 150V; Package Height: 0.6mm; Power Rating: 125mW; Composition: Thick Film; RoHS3Compliant: Yes (with excemption); Number of Pins: 2; Resistance: 1.78k; Reach SVHC Compliant: Unaffected; Case/Package: 0805; Max Operating Temperature: 155°C; Mount: SMD; Resistor Type: Fixed; ComponentLinkURL: https://octopart.com/part/panasonic/ERJ-6ENF1781V; Min Operating Temperature: -55°C; Temperature Coefficient (ppm/cel): ±100ppm; Contact Plating: Tin; Tolerance: 1%

## Sheet microcontroller.SchDoc
size A4; SheetNumber: 5; SheetTotal: 6
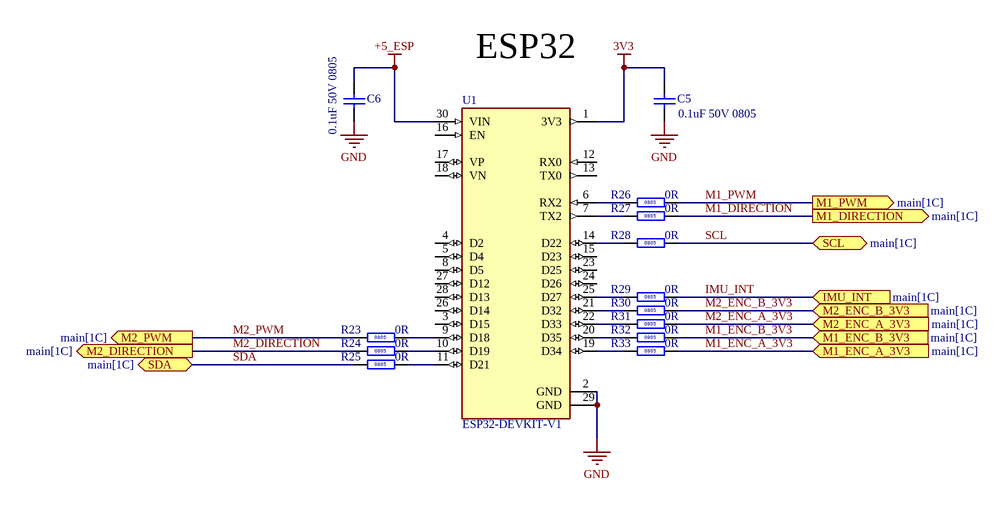
[diagram p5: microcontroller.SchDoc]

### Parts
(Parts that share a designator on the sheet are numbered #1, #2 ... from top to bottom, then left to right.)
C5#2  0.1uF 50V 0805  [CAPC2012X14N]
C6#2  0.1uF 50V 0805  [CAPC2012X14N]
R23  0R  [Copy of RESC2013X60X35NL10T20]
R24  0R  [Copy of RESC2013X60X35NL10T20]
R25  0R  [Copy of RESC2013X60X35NL10T20]
R26  0R  [Copy of RESC2013X60X35NL10T20]
R27  0R  [Copy of RESC2013X60X35NL10T20]
R28  0R  [Copy of RESC2013X60X35NL10T20]
R29  0R  [Copy of RESC2013X60X35NL10T20]
R30  0R  [Copy of RESC2013X60X35NL10T20]
R31  0R  [Copy of RESC2013X60X35NL10T20]
R32  0R  [Copy of RESC2013X60X35NL10T20]
R33  0R  [Copy of RESC2013X60X35NL10T20]
U1  ESP32-DEVKIT-V1  [MODULE_ESP32_DEVKIT_V1]

### Ports
IMU_INT (in, see main[1C]), M1_DIRECTION (out, see main[1C]), M1_ENC_A_3V3 (in, see main[1C]), M1_ENC_B_3V3 (in, see main[1C]), M1_PWM (out, see main[1C]), M2_DIRECTION (out, see main[1C]), M2_ENC_A_3V3 (in, see main[1C]), M2_ENC_B_3V3 (in, see main[1C]), M2_PWM (out, see main[1C]), SCL (bidir, see main[1C]), SDA (bidir, see main[1C])

### Nets
3V3: C5#2.2 U1.1(3V3)
+5_ESP: C6#2.2 U1.30(VIN)
GND: C5#2.1 C6#2.1 U1.2(GND) U1.29(GND)
IMU_INT: R29.2 ; port IMU_INT
M1_DIRECTION: R27.2 ; port M1_DIRECTION
M1_ENC_A_3V3: R33.2 ; port M1_ENC_A_3V3
M1_ENC_B_3V3: R32.2 ; port M1_ENC_B_3V3
M1_PWM: R26.2 ; port M1_PWM
M2_DIRECTION: R24.1 ; port M2_DIRECTION
M2_ENC_A_3V3: R31.2 ; port M2_ENC_A_3V3
M2_ENC_B_3V3: R30.2 ; port M2_ENC_B_3V3
M2_PWM: R23.1 ; port M2_PWM
SCL: R28.2 ; port SCL
SDA: R25.1 ; port SDA
NetR23_2: R23.2 U1.9(D18)
NetR24_2: R24.2 U1.10(D19)
NetR25_2: R25.2 U1.11(D21)
NetR26_1: R26.1 U1.6(RX2)
NetR27_1: R27.1 U1.7(TX2)
NetR28_1: R28.1 U1.14(D22)
NetR29_1: R29.1 U1.25(D27)
NetR30_1: R30.1 U1.21(D32)
NetR31_1: R31.1 U1.22(D33)
NetR32_1: R32.1 U1.20(D35)
NetR33_1: R33.1 U1.19(D34)

Not connected (* = marked no-connect by the designer): U1 3(D15) 4(D2) 5(D4) 8(D5) 12(RX0) 13(TX0) 15(D23) 16(EN) 17(VP) 18(VN) 23(D25) 24(D26) 26(D14) 27(D12) 28(D13)

### Notes on the sheet
- ESP32

### Library data of the parts
C5#2 C6#2 = CMP-40-005-00117-1: as C4#1 on sheet power; Package: 0805; MountingType: SMD; VoltageRating: 50V; Tolerance: 10%; ComponentLinkURL: https://octopart.com/part/samsung-electro-mechanics/CL21B104KBCWPNC; DielectricType: Ceramic
R23-R33 = CMP-40-025-00156-5: as R34 on sheet Level_Shifter; Termination: Wraparound; Mounting Technology: Surface Mount; Resistor Type: FIXED RESISTOR; MountingType: SMD; Max Operating Temperature: 155°C; Construction: Chip; RoHS Compliant: Yes; Power: 125mW; Tolerance: 1%; Packaging: Tape and Reel; Pins: 2; Min Operating Temperature: -55°C; Package: 0805; Terminal Finish: Nickel; Package Style: SMTMeter; Case/Package: 0805; Package Shape: Rectangular; ComponentLinkURL: https://datasheet.ciiva.com/pdfs/VipMasterIC/IC/YAGO/YAGO-S-A0008145938/YAGO-S-A0008145938-1.pdf?src-supplier=IHS+Markit; Minimum Operating Temperature: -55°C; Technology: METAL GLAZE/THICK FILM; JESD-609 Code: e3; Maximum Operating Temperature: 155°C; Reach SVHC Compliant: Yes
U1 = ESP32-DEVKIT-V1: Dual core, Wi-Fi: 2.4 GHz up to 150 Mbits/s,BLE (Bluetooth Low Energy) and legacy Bluetooth, 32 bits, Up to 240 MHz; MF: Do it; SnapEDA_Link: https://www.snapeda.com/parts/ESP32-DEVKIT-V1/Do+it/view-part/?ref=snap; Package: None; Value: *; MP: ESP32-DEVKIT-V1; Check_prices: https://www.snapeda.com/parts/ESP32-DEVKIT-V1/Do+it/view-part/?ref=eda

## Nets that join several sheets
3V3: Level_Shifter (C2#2.2 R18.1 U2#2.1), headers (C7#2.2 J9.1 J9.4 J9.5), Debug (R16.2), microcontroller (C5#2.2 U1.1)
+5: Level_Shifter (C4#2.2 U2#2.14), headers (5 pins), Debug (R15.2)
BAT_POWER: headers (J6.3 R21.1), Debug (R14.2 R20.2)
GND: Level_Shifter (C2#2.1 C4#2.1 U2#2.7), headers (28 pins), Debug (D2.2 D3.2 D4.2 D5.2), microcontroller (C5#2.1 C6#2.1 U1.2 U1.29)

## Assembly variants
Main: not fitted R44 R45